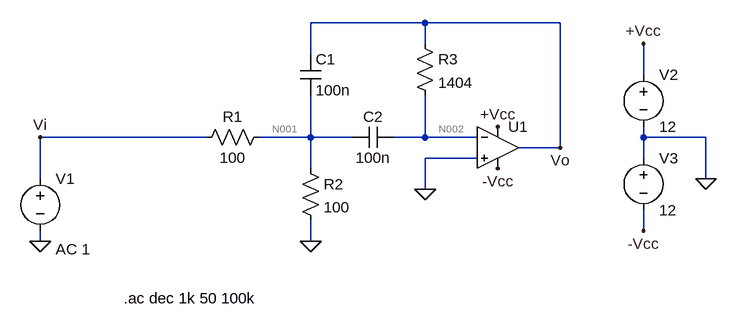
[diagram p0: schematic Tplab1_MFB.asc]
Tplab1_MFB.asc, the LTspice schematic file:
Version 4.1
SHEET 1 880 680
WIRE 288 -32 112 -32
WIRE 496 -32 288 -32
WIRE 288 0 288 -32
WIRE 112 16 112 -32
WIRE 624 48 624 0
WIRE -48 144 -304 144
WIRE 112 144 112 80
WIRE 112 144 32 144
WIRE 176 144 112 144
WIRE 288 144 288 80
WIRE 288 144 240 144
WIRE 368 144 288 144
WIRE 624 144 624 128
WIRE 720 144 624 144
WIRE 496 160 496 -32
WIRE 496 160 432 160
WIRE 368 176 288 176
WIRE 624 176 624 144
WIRE 112 192 112 144
WIRE -304 208 -304 144
WIRE 720 208 720 144
WIRE 288 224 288 176
WIRE 624 288 624 256
WIRE -304 304 -304 288
WIRE 112 304 112 272
FLAG 288 224 0
FLAG 112 304 0
FLAG -304 304 0
FLAG 720 208 0
FLAG 624 0 +Vcc
FLAG 400 128 +Vcc
FLAG 624 288 -Vcc
FLAG 400 192 -Vcc
FLAG -304 144 Vi
FLAG 496 160 Vo
SYMBOL res 48 128 R90
WINDOW 0 0 56 VBottom 2
WINDOW 3 32 56 VTop 2
SYMATTR InstName R1
SYMATTR Value 100
SYMBOL res 96 176 R0
SYMATTR InstName R2
SYMATTR Value 100
SYMBOL res 272 -16 R0
SYMATTR InstName R3
SYMATTR Value 1404
SYMBOL cap 96 16 R0
SYMATTR InstName C1
SYMATTR Value 100n
SYMBOL cap 240 128 R90
WINDOW 0 0 32 VBottom 2
WINDOW 3 32 32 VTop 2
SYMATTR InstName C2
SYMATTR Value 100n
SYMBOL OpAmps\\UniversalOpAmp 400 160 R0
SYMATTR InstName U1
SYMBOL voltage -304 192 R0
WINDOW 123 24 124 Left 2
WINDOW 39 0 0 Left 0
SYMATTR Value2 AC 1
SYMATTR InstName V1
SYMATTR Value ""
SYMBOL voltage 624 32 R0
WINDOW 123 0 0 Left 0
WINDOW 39 0 0 Left 0
SYMATTR InstName V2
SYMATTR Value 12
SYMBOL voltage 624 160 R0
WINDOW 123 0 0 Left 0
WINDOW 39 0 0 Left 0
SYMATTR InstName V3
SYMATTR Value 12
TEXT -176 392 Left 2 !.ac dec 1k 50 100k

The netlist it stands for:
* Tplab1_MFB.asc
R1 N001 Vi 100
R2 N001 0 100
R3 Vo N002 1404
C1 Vo N001 100n
C2 N002 N001 100n
X§U1 0 N002 +Vcc -Vcc Vo level1 Avol=1Meg GBW=10Meg Vos=0 En=0 Enk=0 In=0 Ink=0 Rin=500Meg  ; pins In+ In- V+ V- OUT
V1 Vi 0 AC 1
V2 +Vcc 0 12
V3 0 -Vcc 12
.ac dec 1k 50 100k
.lib UniversalOpAmp1.lib
.backanno
.end

* Results of the author's LTspice run, read from the files saved beside the schematic
* Operating Point, zero values left out:
*   V(+vcc) = 12 V
*   V(-vcc) = -12 V
*   I(V3) = -24 nA
*   I(V2) = -24 nA
*   Ix(u1:3) = 24 nA
*   Ix(u1:4) = -24 nA
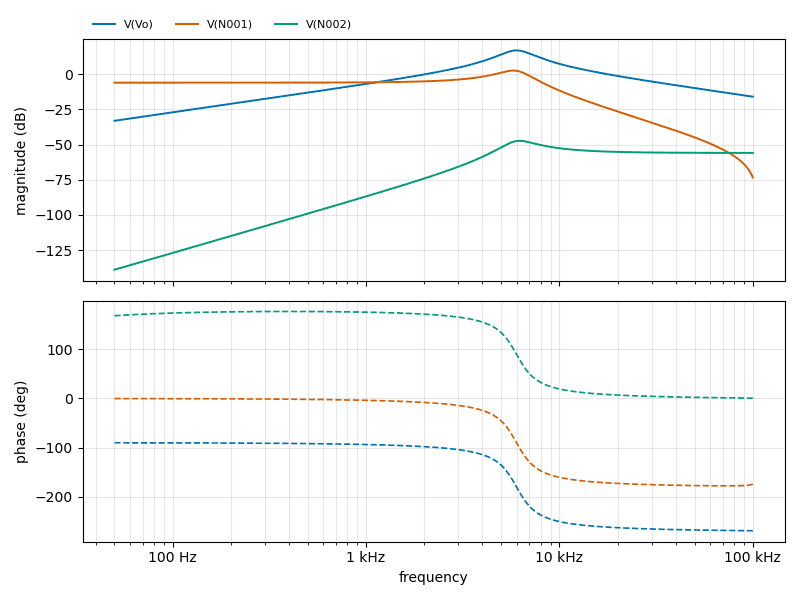
[diagram p1: AC Analysis of Tplab1_MFB.asc, plotted from the saved traces]
* AC Analysis, 1 run:
*   V(Vo): -33.13 dB at 50 Hz, -15.96 dB at 100 kHz, peak 16.93 dB at 5.997 kHz, 3 dB below the peak at 4.973 kHz and 7.233 kHz
*   V(N001): -6.02 dB at 50 Hz, -73.42 dB at 100 kHz, peak 2.59 dB at 5.781 kHz, 3 dB below the peak at 4.48 kHz and 6.833 kHz
*   V(N002): -138.98 dB at 50 Hz, -55.96 dB at 100 kHz, peak -47.36 dB at 6.223 kHz, 3 dB below the peak at 5.262 kHz and 8.022 kHz